# EAGLE schematic LED-Globe (EAGLE 8.5.1)

## Sheet 1 of 2
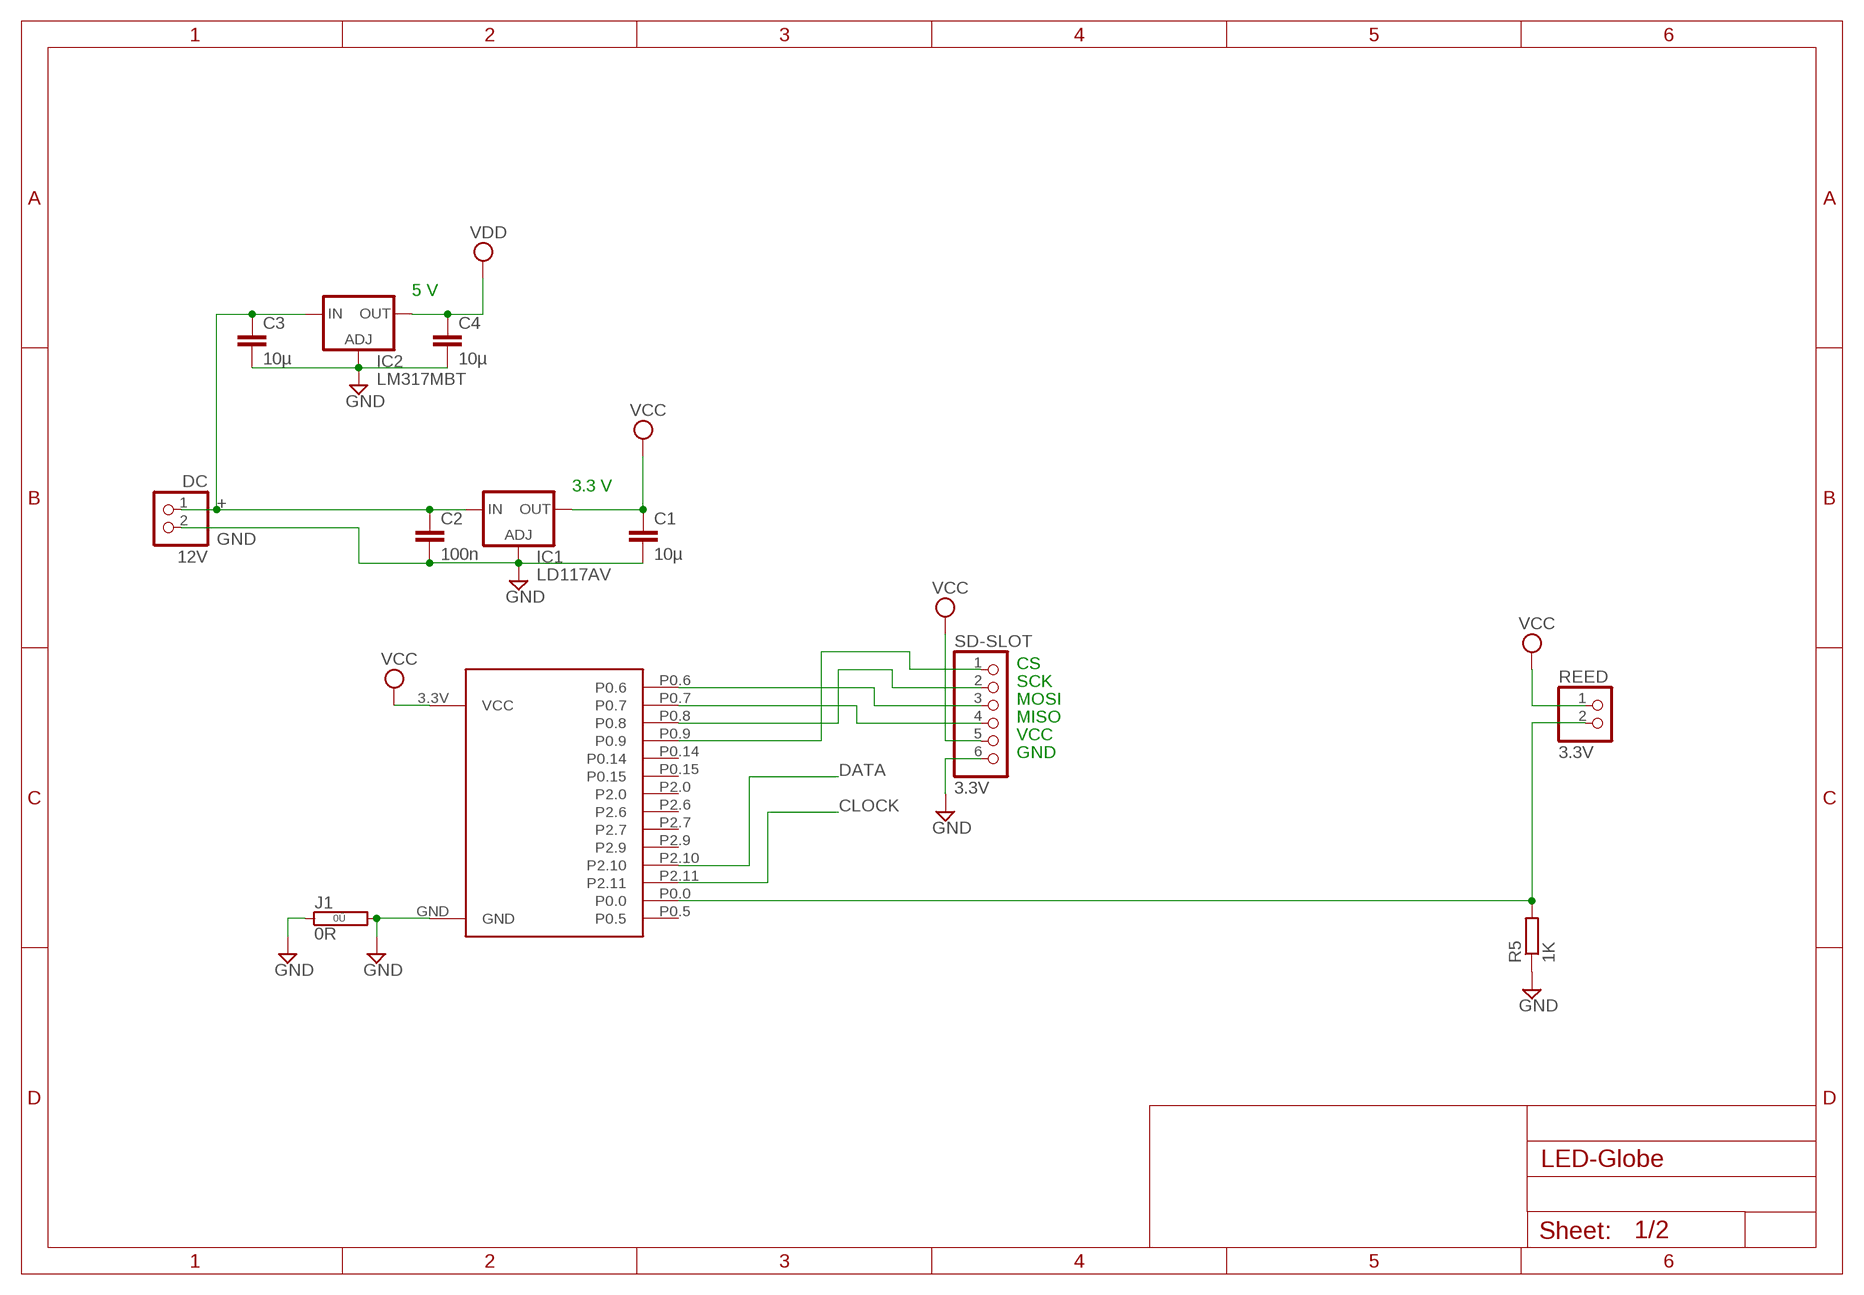
[diagram p0: schematic, sheet 1]

### Parts
C1  10µ  C-EU025-024X044  [C025-024X044]
C2  100n  C-EU050-024X044  [C050-024X044]
C3  10µ  C-EU025-024X044  [C025-024X044]
C4  10µ  C-EU025-024X044  [C025-024X044]
DC  12V  PINHD-1X2  [1X02]
IC1  LD117AV  [TO220L1]
IC2  LM317MBT  [TO220L1]
J1  0R  [0R/10]
R5  1K  R-EU_0207/10  [0207/10]
REED  3.3V  PINHD-1X2  [1X02]
SD-SLOT  3.3V  PINHD-1X6  [1X06]
XMC1  XMC2GO  [XMC2GO]

### Nets
+: C2.1 C3.1 DC.1 IC1.3(IN) IC2.3(IN)
CLOCK: XMC1.P2.11 ; also sheet 2
DATA: XMC1.P2.10 ; also sheet 2
GND: C1.2 C2.2 C3.2 C4.2 DC.2 IC1.1(ADJ) IC2.1(ADJ) J1.1 J1.2 R5.1 SD-SLOT.6 XMC1.GND ; also sheet 2
N$6: R5.2 REED.2 XMC1.P0.0
N$7: SD-SLOT.3 XMC1.P0.6
N$8: SD-SLOT.4 XMC1.P0.7
N$9: SD-SLOT.2 XMC1.P0.8
N$10: SD-SLOT.1 XMC1.P0.9
VCC: C1.1 IC1.2(OUT) REED.1 SD-SLOT.5 XMC1.3.3V(VCC)
VDD: C4.1 IC2.2(OUT) ; also sheet 2
Unconnected: XMC1.P0.5 XMC1.P0.14 XMC1.P0.15 XMC1.P2.0 XMC1.P2.6 XMC1.P2.7 XMC1.P2.9

### Notes on the sheet
- 5 V
- 3.3 V
- CS
- SCK
- MOSI
- MISO
- VCC
- GND

## Sheet 2 of 2
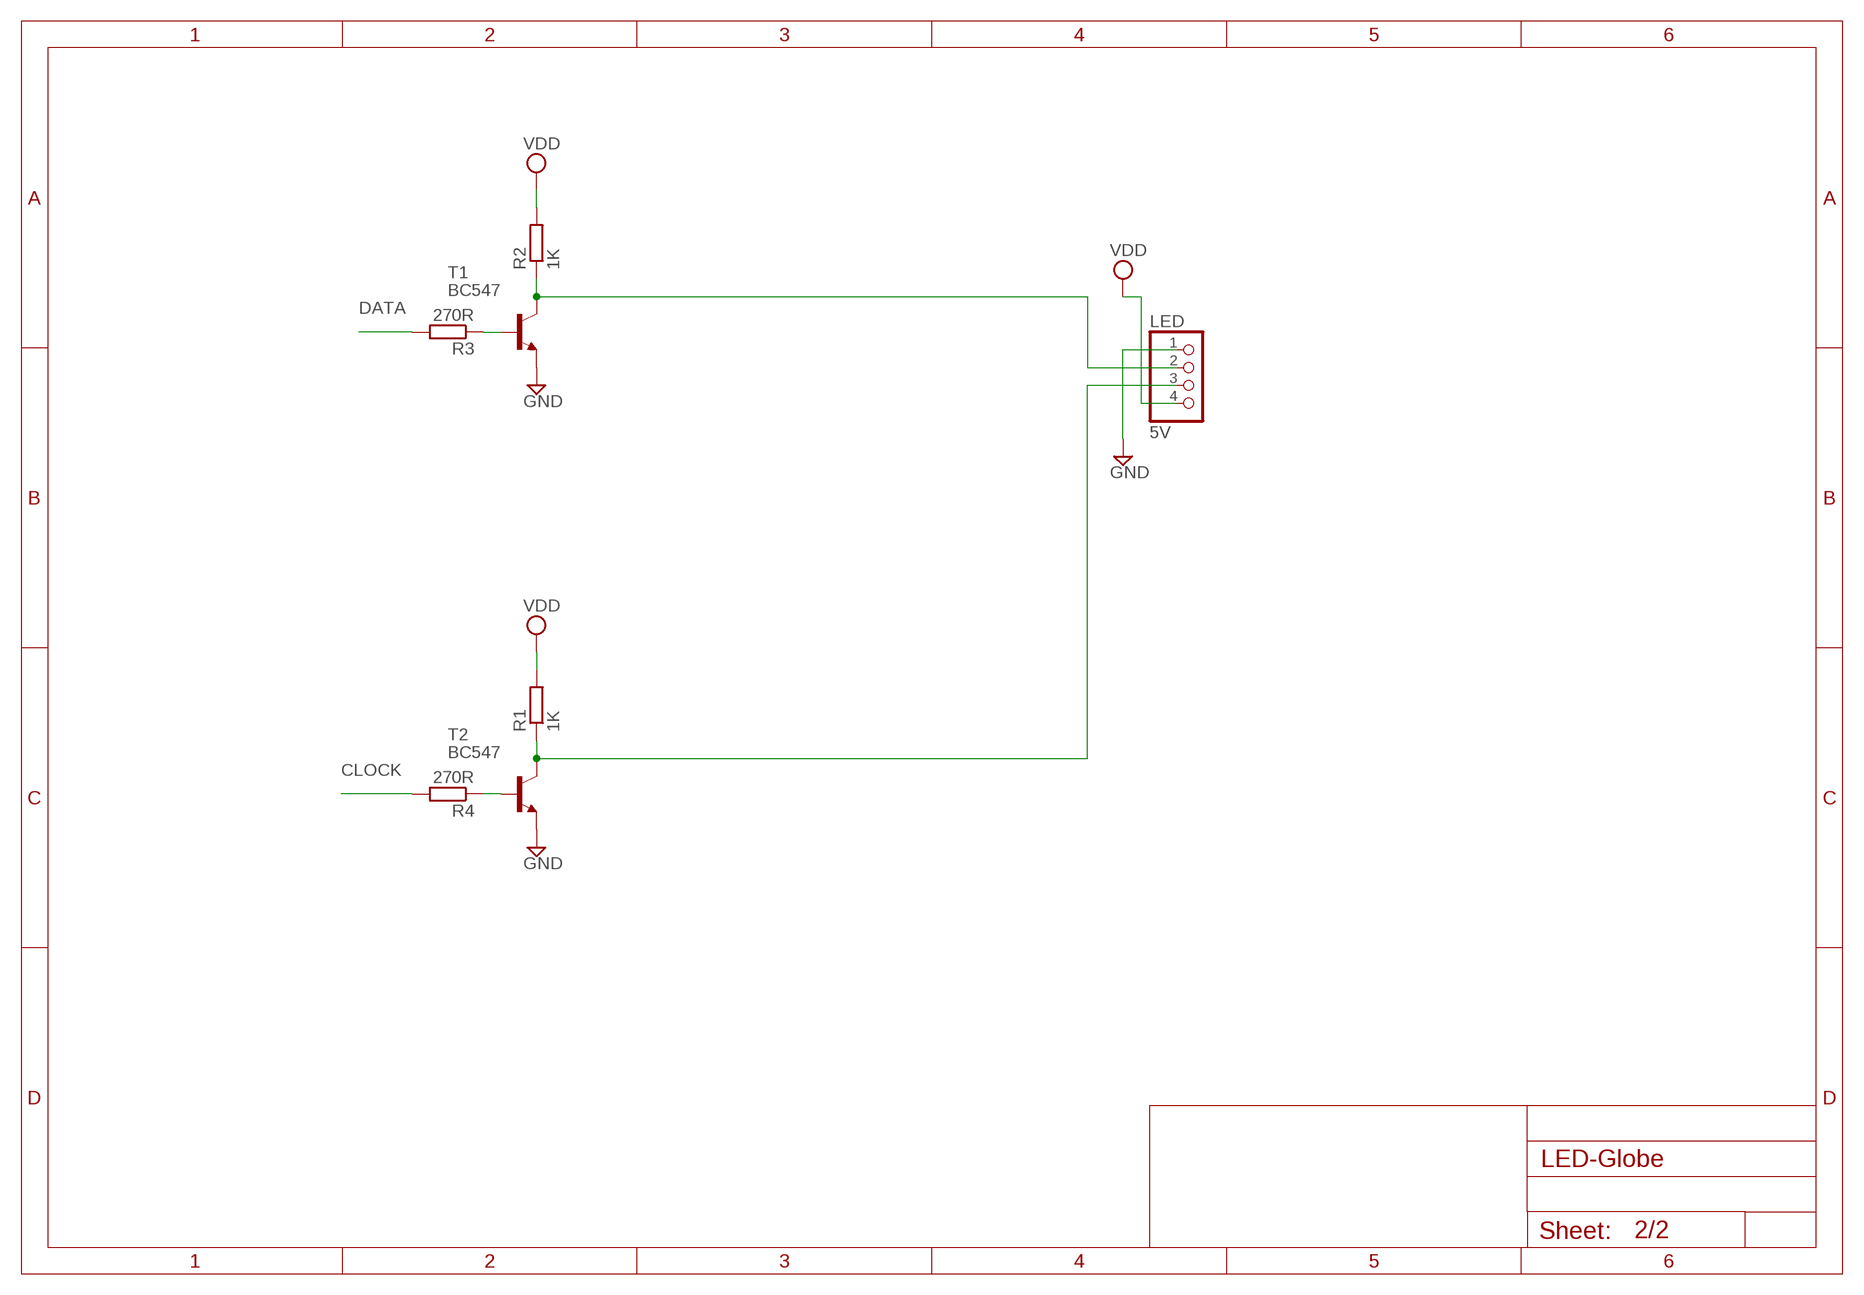
[diagram p1: schematic, sheet 2]

### Parts
LED  5V  PINHD-1X4  [1X04]
R1  1K  R-EU_0207/10  [0207/10]
R2  1K  R-EU_0207/10  [0207/10]
R3  270R  R-EU_0207/10  [0207/10]
R4  270R  R-EU_0207/10  [0207/10]
T1  BC547  [TO92]
T2  BC547  [TO92]

### Nets
CLOCK: R4.2 ; also sheet 1
DATA: R3.2 ; also sheet 1
GND: LED.1 T1.1(E) T2.1(E) ; also sheet 1
N$1: R3.1 T1.2(B)
N$3: LED.2 R2.1 T1.3(C)
N$4: LED.3 R1.1 T2.3(C)
N$5: R4.1 T2.2(B)
VDD: LED.4 R1.2 R2.2 ; also sheet 1

## Library data of the parts
C1-C4 = rcl:C-EU: CAPACITOR, European symbol; SPICEPREFIX: C
DC REED = pinhead:PINHD-1X2: PIN HEADER
IC1 = v-reg:LD117A?*: Low drop fixed and adjustable positive voltage regulators 1 A Source: http://www.st.com/stonline/products/literature/ds/7194/ld1117axx.pdf
IC2 = v-reg:LM317?*: 500 mA Adjustable Output Positive Voltage Regulator Source: http://www.onsemi.co.jp .. LM317M-D.PDF
J1 = jumper:0R: Bridge 0R 10mm
LED = pinhead:PINHD-1X4: PIN HEADER
R1-R5 = rcl:R-EU_: RESISTOR, European symbol; SPICEPREFIX: R
SD-SLOT = pinhead:PINHD-1X6: PIN HEADER
T1 T2 = transistor:BC547: NPN TRANSISTOR
XMC1 = XMC2GO:XMC2GO